# EAGLE schematic Hive_Max_Masse_neu4a (EAGLE 6.3)
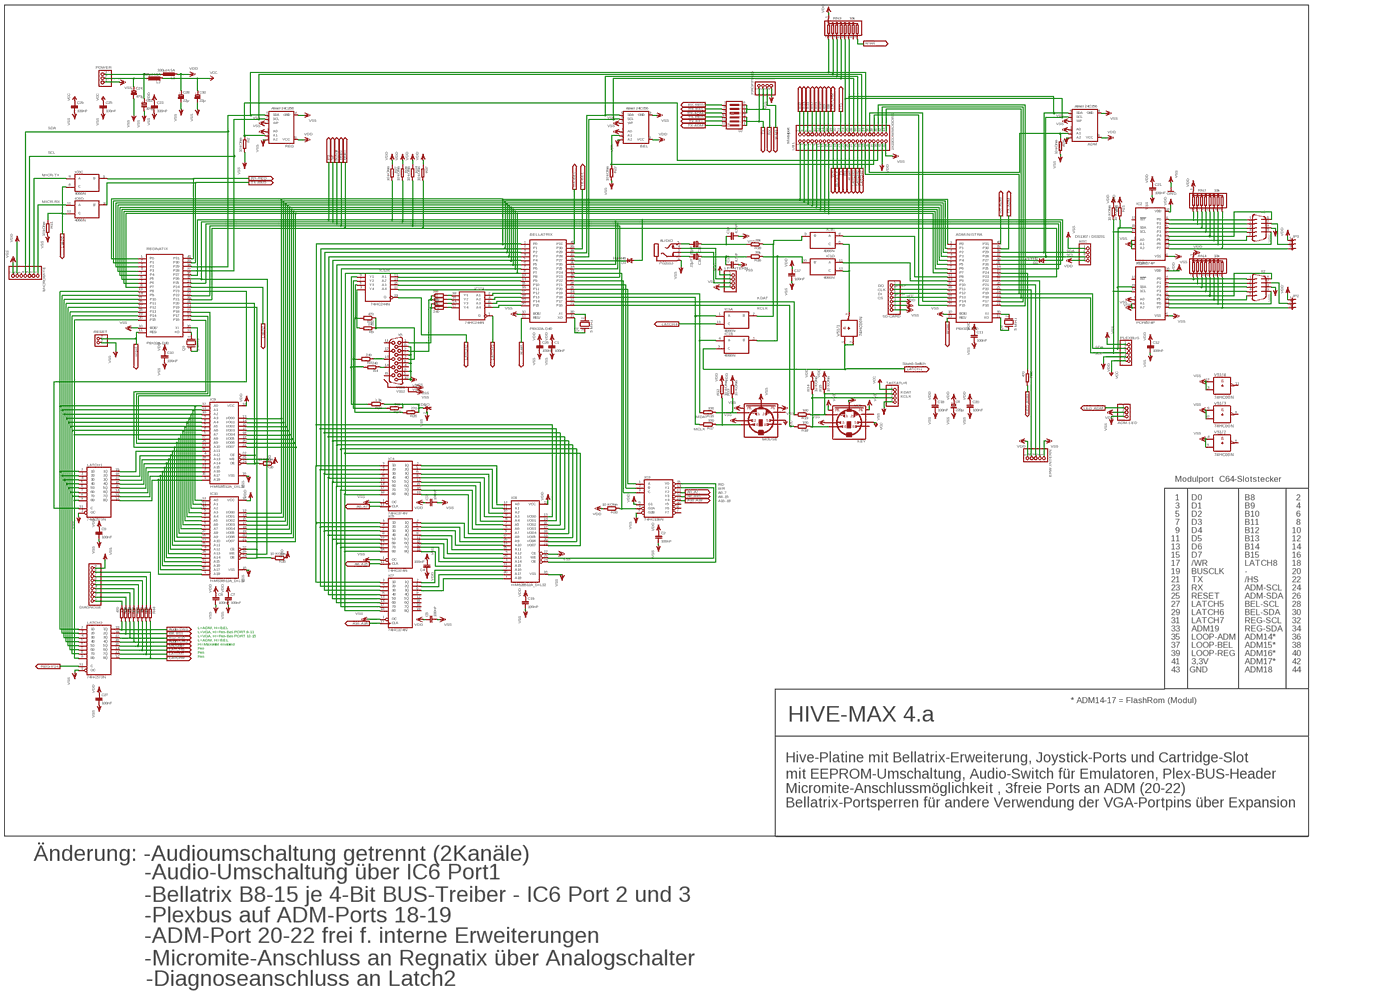
[diagram p0: schematic, sheet 1, overview]
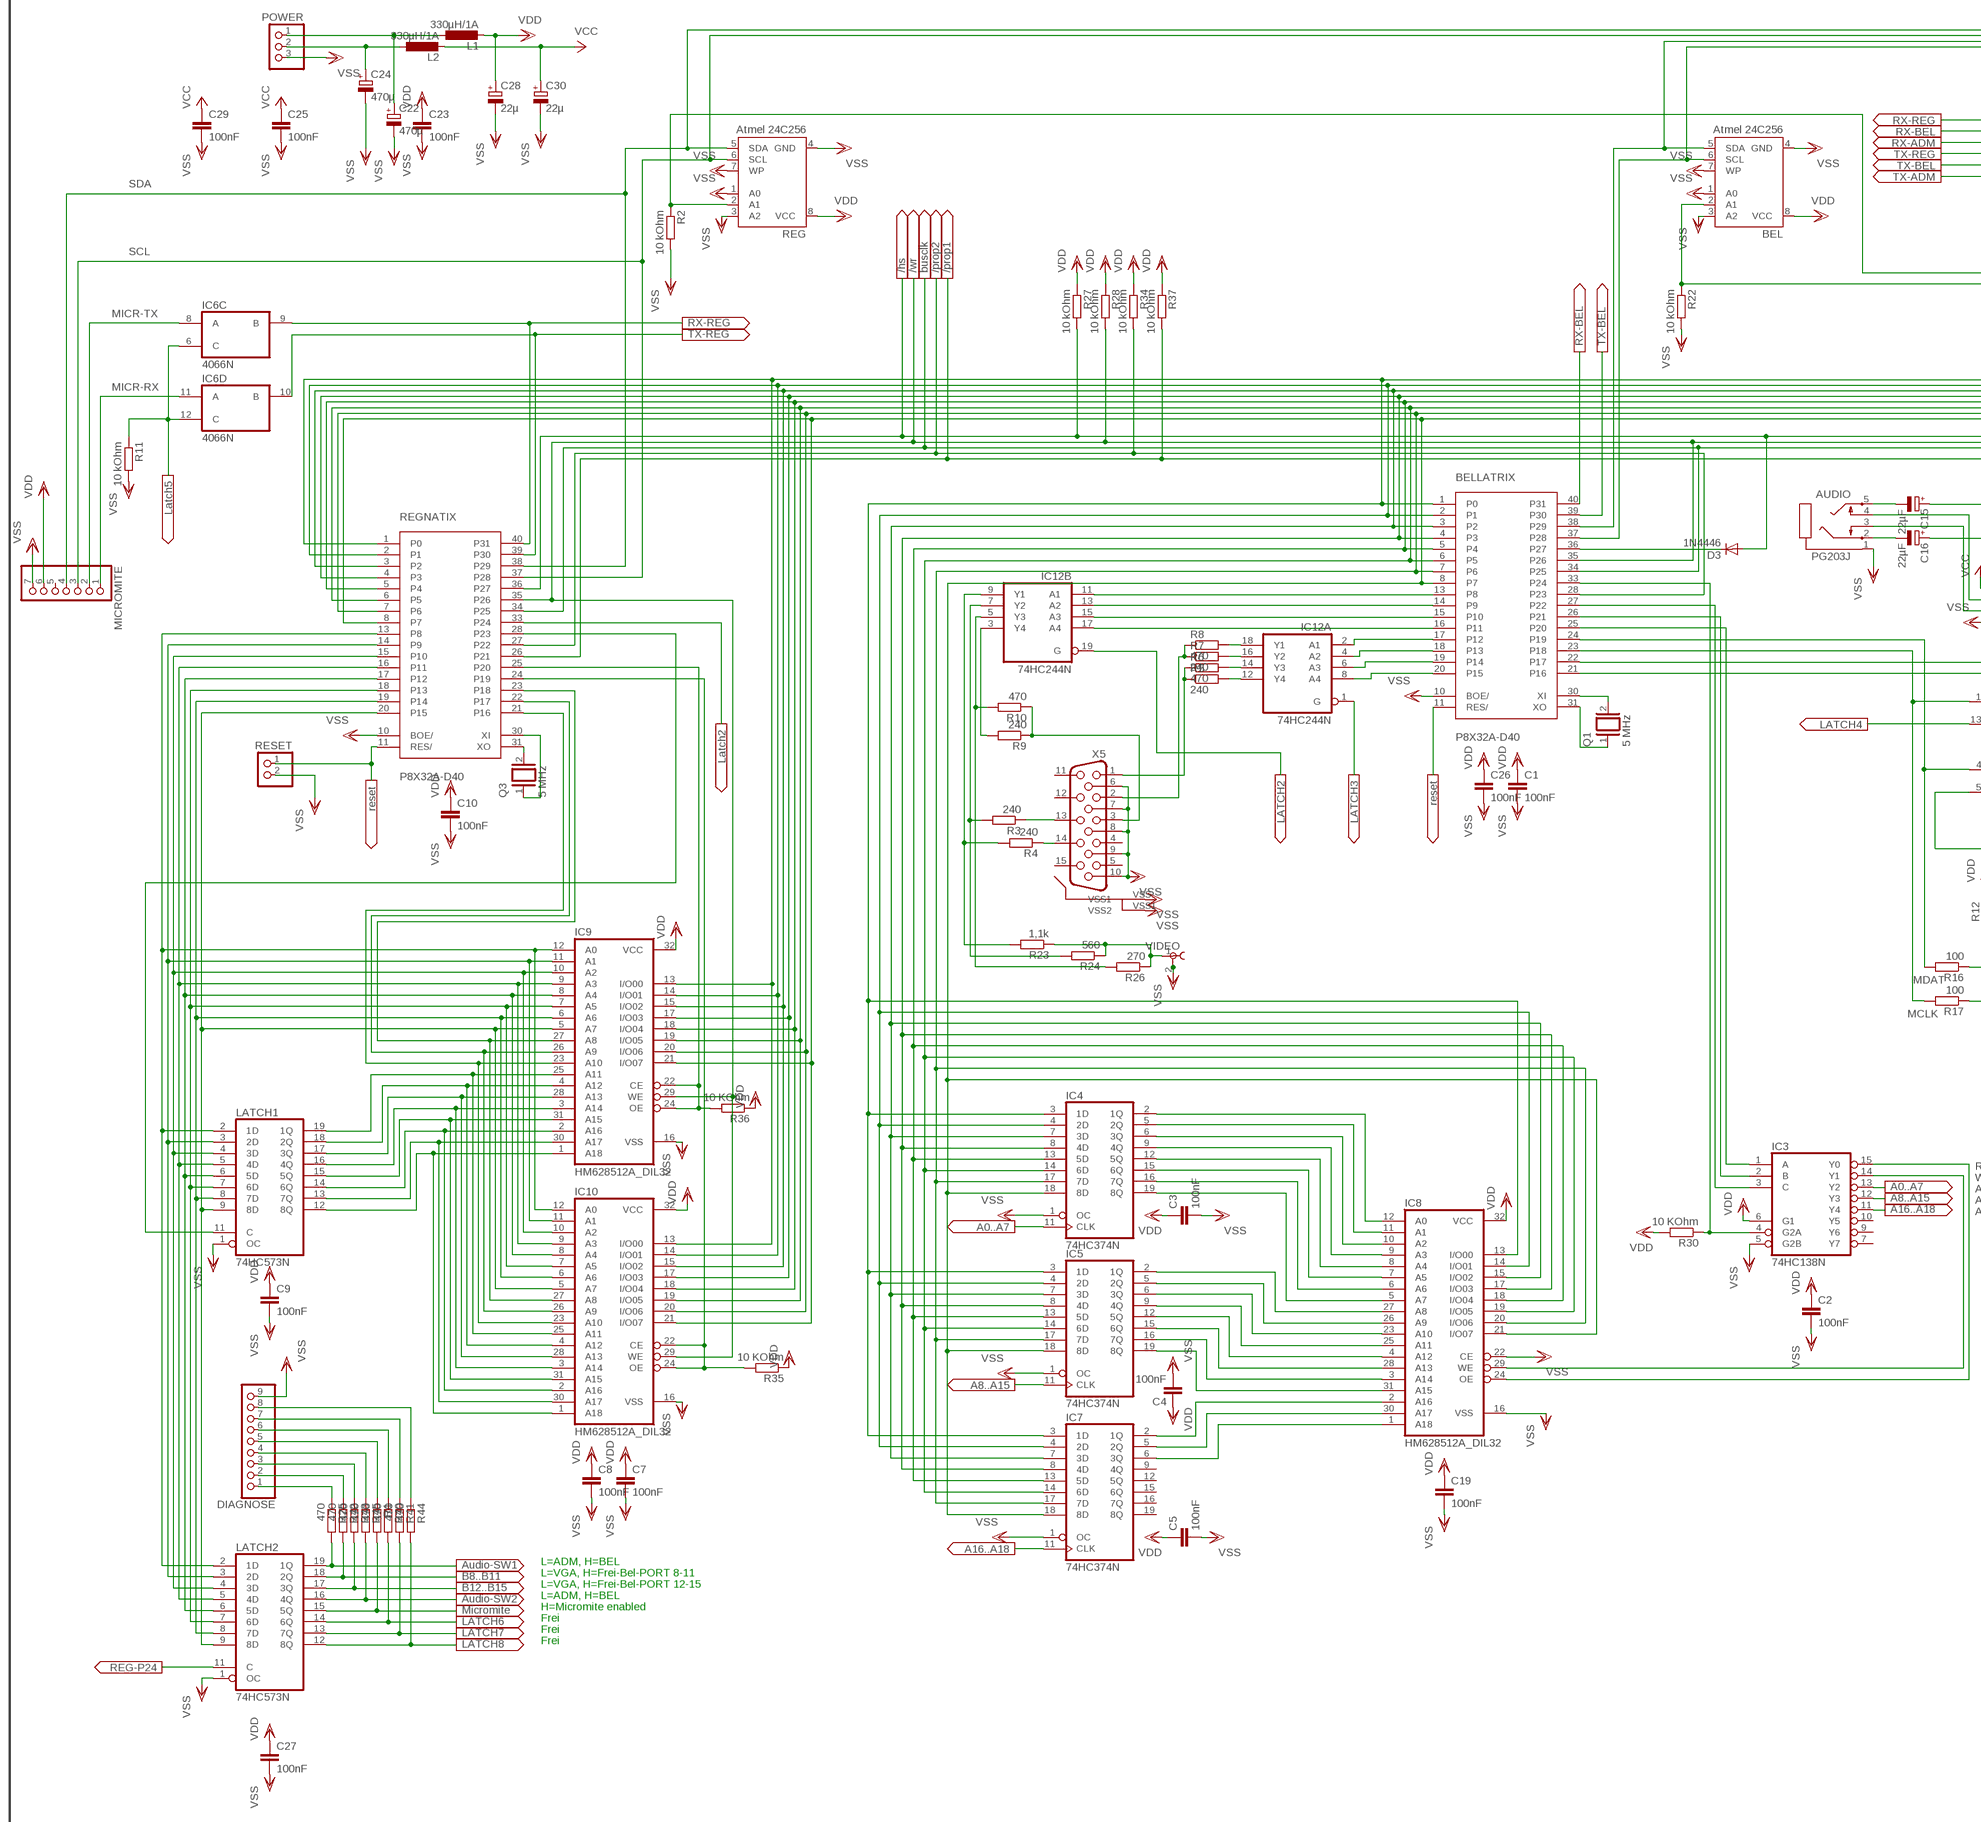
[diagram p1: schematic, sheet 1, part 1 of 4]
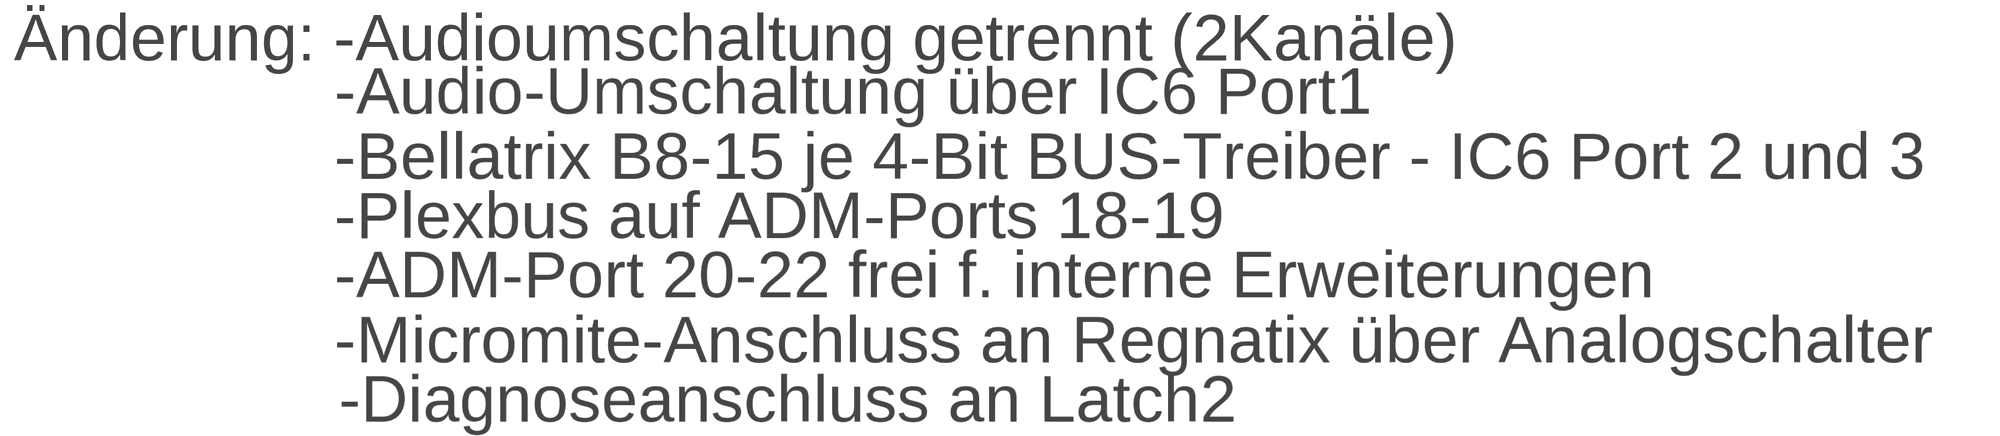
[diagram p2: schematic, sheet 1, part 2 of 4]
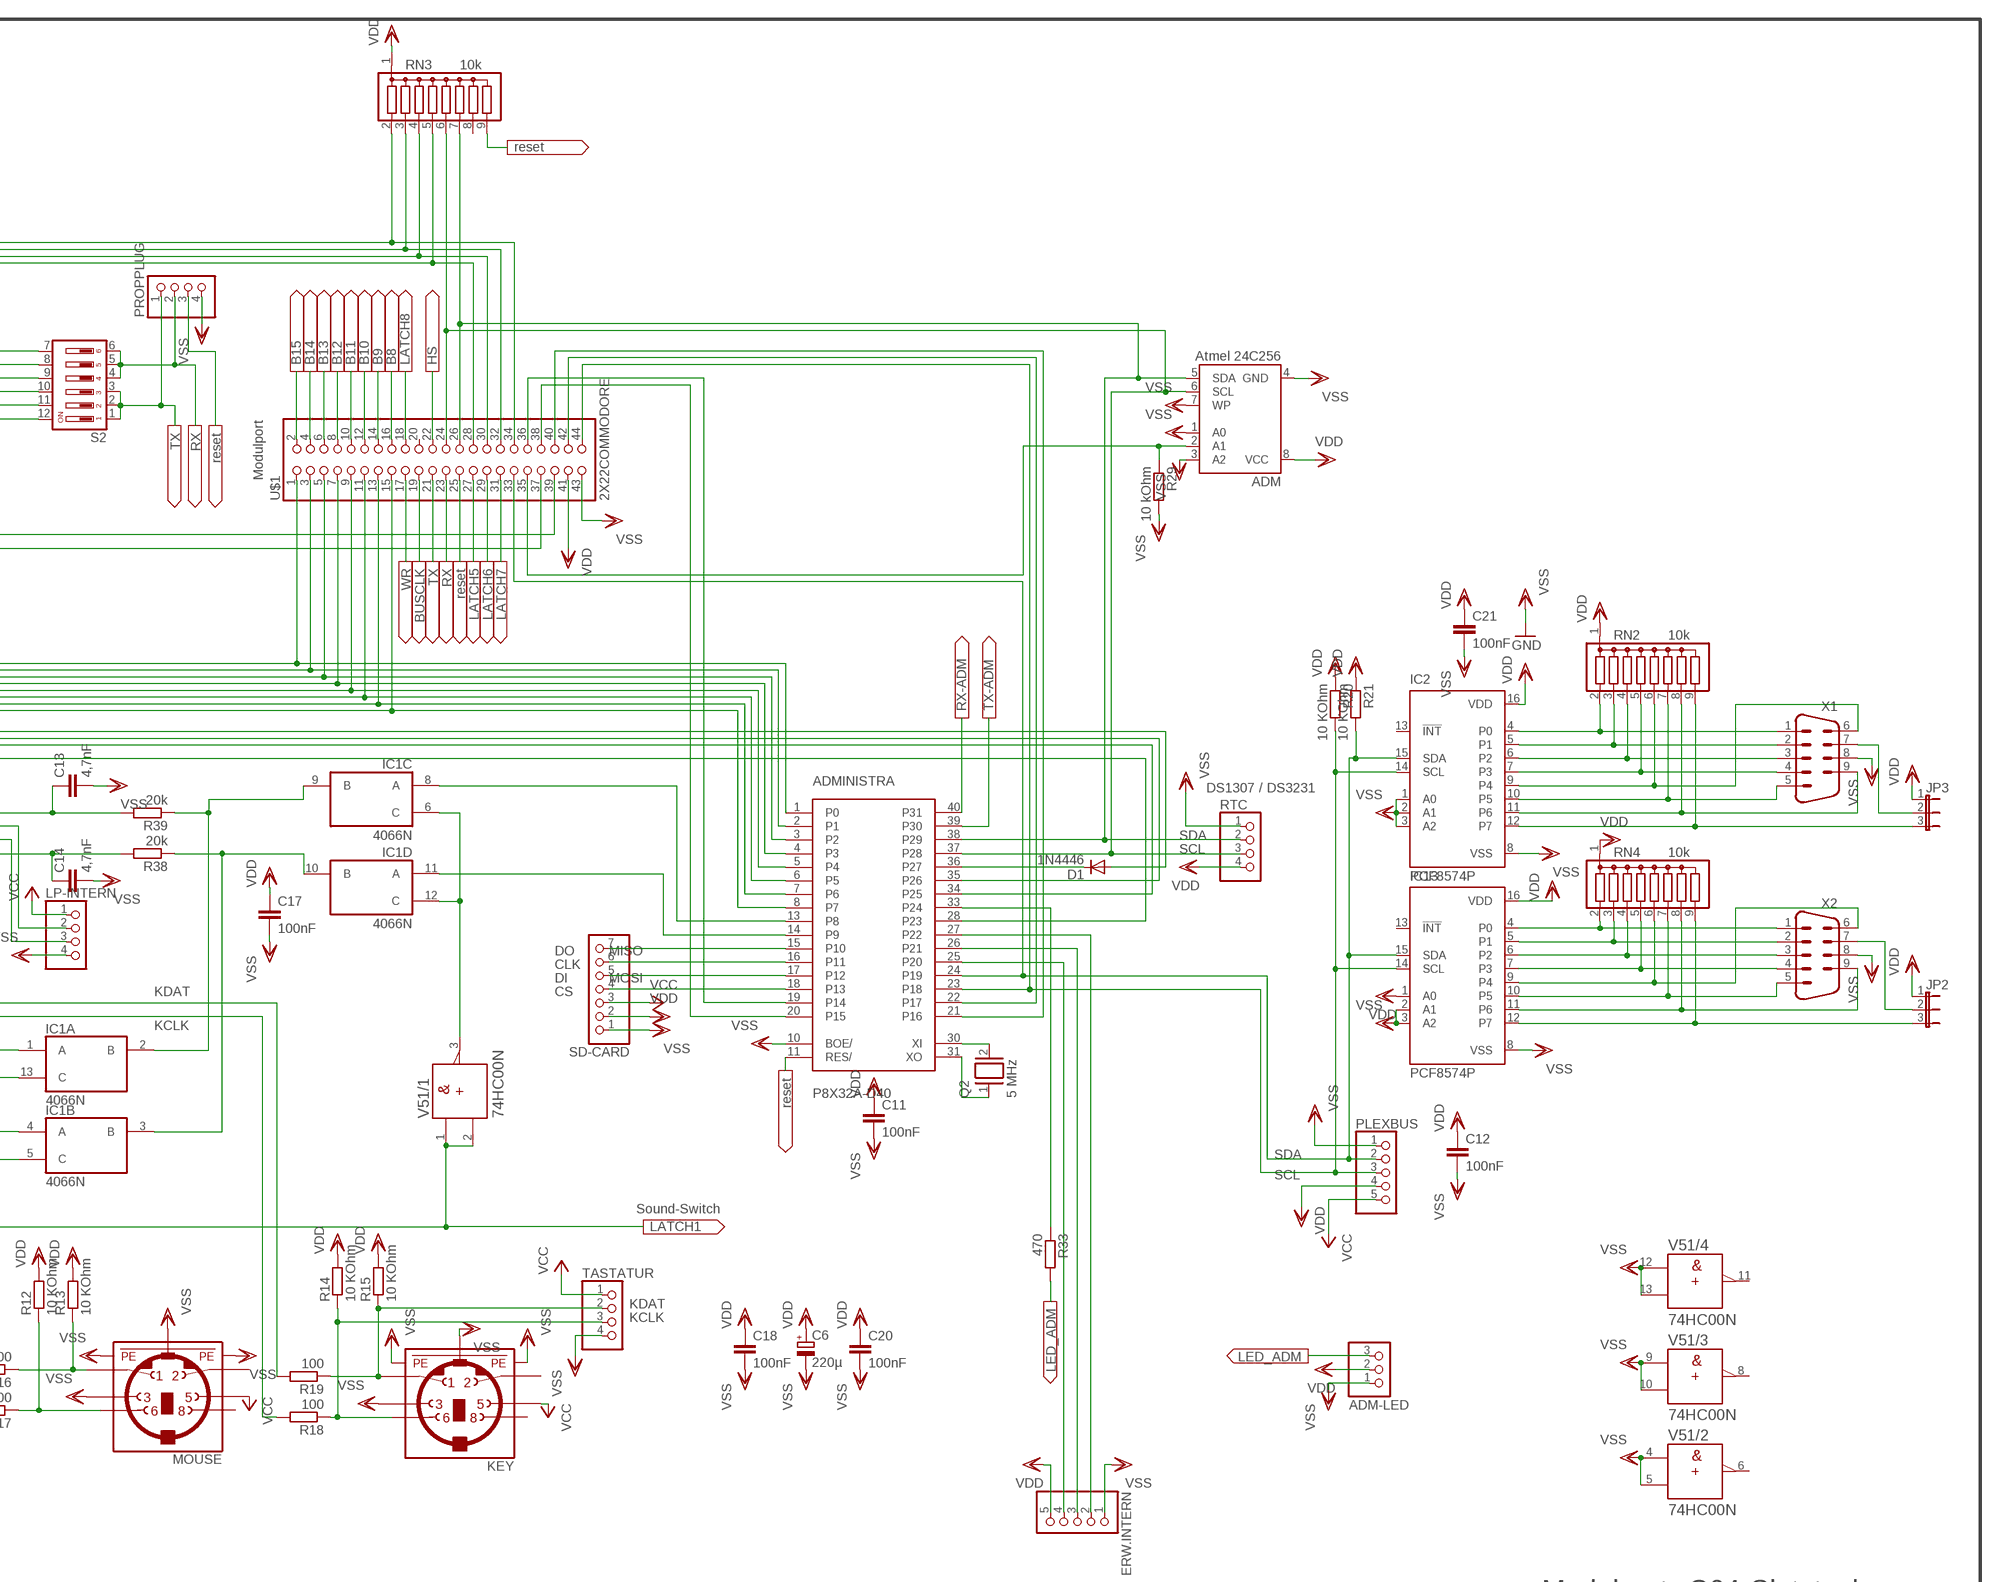
[diagram p3: schematic, sheet 1, part 3 of 4]
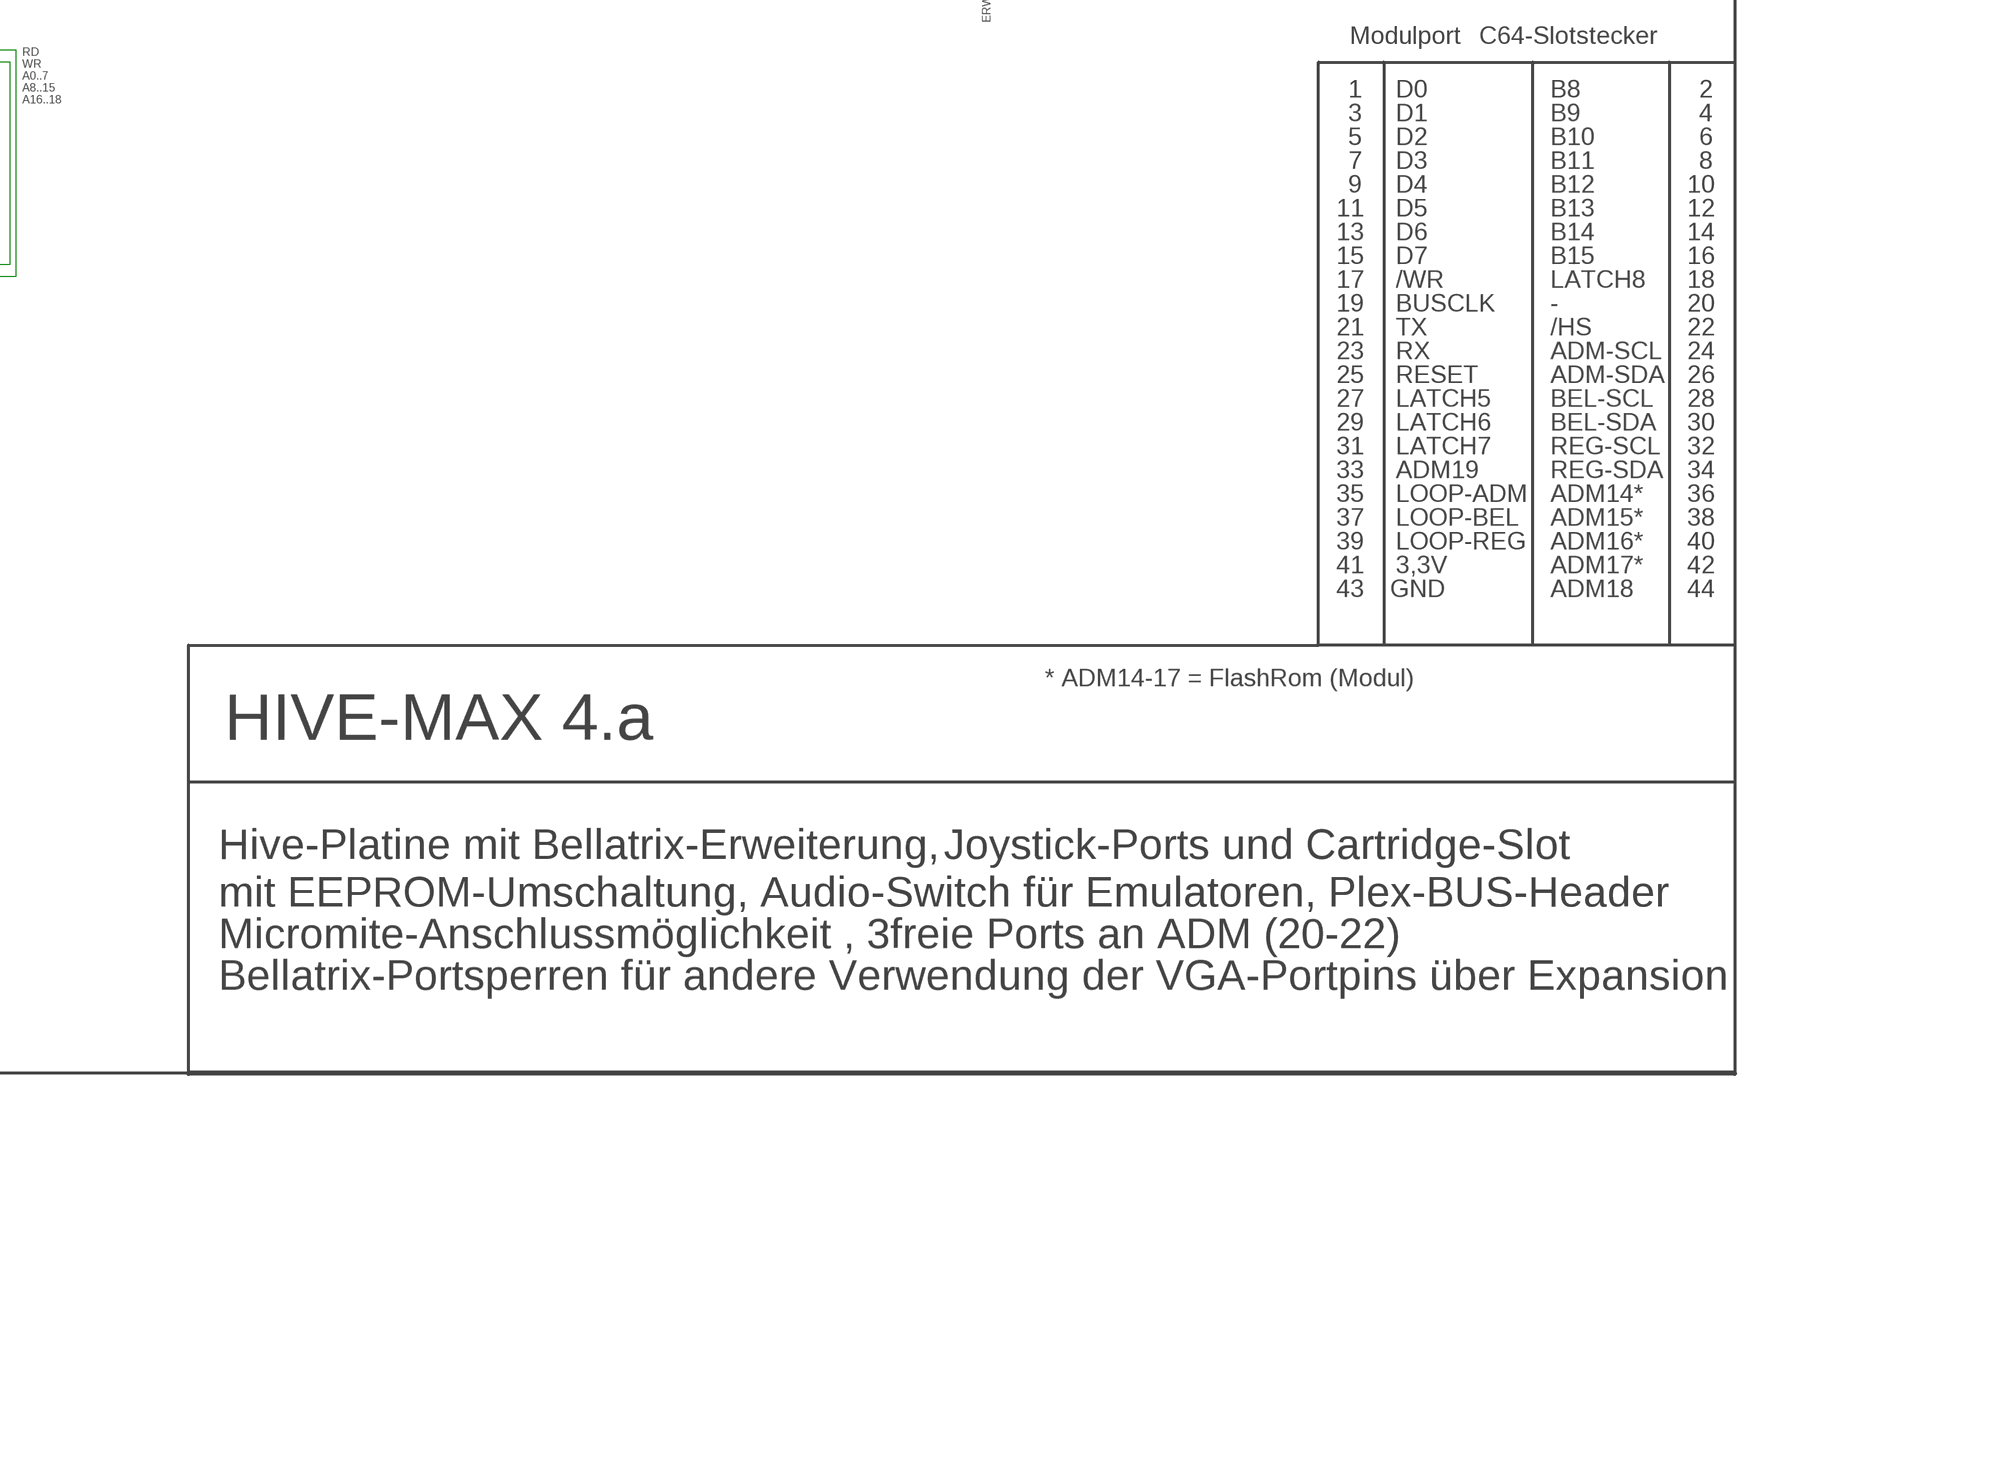
[diagram p4: schematic, sheet 1, part 4 of 4]

## Parts
ADM  Atmel 24C256  AT24CP  [DIL08]
ADM-LED  PINHD-1X3  [1X03]
ADMINISTRA  P8X32A-D40  [P8X32A-D40]
AUDIO  PG203J  [PG203J]
BEL  Atmel 24C256  AT24CP  [DIL08]
BELLATRIX  P8X32A-D40  [P8X32A-D40]
C1  100nF  C-EU025-030X050  [C025-030X050]
C2  100nF  C-EU025-030X050  [C025-030X050]
C3  100nF  C-EU025-030X050  [C025-030X050]
C4  100nF  C-EU025-030X050  [C025-030X050]
C5  100nF  C-EU025-030X050  [C025-030X050]
C6  220µ  CPOL-EUE5-8.5  [E5-8,5]
C7  100nF  C-EU025-030X050  [C025-030X050]
C8  100nF  C-EU025-030X050  [C025-030X050]
C9  100nF  C-EU025-030X050  [C025-030X050]
C10  100nF  C-EU025-030X050  [C025-030X050]
C11  100nF  C-EU025-030X050  [C025-030X050]
C12  100nF  C-EU025-030X050  [C025-030X050]
C13  4,7nF  C-EU025-030X050  [C025-030X050]
C14  4,7nF  C-EU025-030X050  [C025-030X050]
C15  22µF  CPOL-EUE2-5  [E2-5]
C16  22µF  CPOL-EUE2-5  [E2-5]
C17  100nF  C-EU025-030X050  [C025-030X050]
C18  100nF  C-EU025-030X050  [C025-030X050]
C19  100nF  C-EU025-030X050  [C025-030X050]
C20  100nF  C-EU025-030X050  [C025-030X050]
C21  100nF  C-EU025-030X050  [C025-030X050]
C22  470µ  CPOL-EUE5-8.5  [E5-8,5]
C23  100nF  C-EU025-030X050  [C025-030X050]
C24  470µ  CPOL-EUE5-8.5  [E5-8,5]
C25  100nF  C-EU025-030X050  [C025-030X050]
C26  100nF  C-EU025-030X050  [C025-030X050]
C27  100nF  C-EU025-030X050  [C025-030X050]
C28  22µ  CPOL-EUE2-5  [E2-5]
C29  100nF  C-EU025-030X050  [C025-030X050]
C30  22µ  CPOL-EUE2-5  [E2-5]
D1  1N4446  [DO35-10]
D3  1N4446  [DO35-10]
DIAGNOSE  PINHD-1X9  [1X09]
ERW.INTERN  PINHD-1X5  [1X05]
IC1  4066N  [DIL14]
IC2  PCF8574P  [DIL16]
IC3  74HC138N  [DIL16]
IC4  74HC374N  [DIL20]
IC5  74HC374N  [DIL20]
IC6  4066N  [DIL14]
IC7  74HC374N  [DIL20]
IC8  HM628512A_DIL32  [DIL32]
IC9  HM628512A_DIL32  [DIL32]
IC10  HM628512A_DIL32  [DIL32]
IC12  74HC244N  [DIL20]
IC13  PCF8574P  [DIL16]
JP2  JP2E  [JP2]
JP3  JP2E  [JP2]
KEY  MINI_DIN_6  [M_DIN6]
L1  330µH/1A  L-EU6000-XXX-RC  [6000-XXXX-RC]
L2  330µH/1A  L-EU6000-XXX-RC  [6000-XXXX-RC]
LATCH1  74HC573N  [DIL20]
LATCH2  74HC573N  [DIL20]
LP-INTERN  PINHD-1X4  [1X04]
MICROMITE  PINHD-1X7  [1X07]
MOUSE  MINI_DIN_6  [M_DIN6]
PLEXBUS  PINHD-1X5  [1X05]
POWER  PINHD-1X3  [1X03]
PROPPLUG  PINHD-1X4/90  [1X04/90]
Q1  5 MHz  XTAL/S  [QS]
Q2  5 MHz  XTAL/S  [QS]
Q3  5 MHz  XTAL/S  [QS]
R1  470  R-EU_0204/2V  [0204V]
R2  10 kOhm  R-EU_0204/2V  [0204V]
R3  240  R-EU_0204/2V  [0204V]
R4  240  R-EU_0204/2V  [0204V]
R5  240  R-EU_0204/2V  [0204V]
R6  470  R-EU_0204/2V  [0204V]
R7  240  R-EU_0204/2V  [0204V]
R8  470  R-EU_0204/2V  [0204V]
R9  240  R-EU_0204/2V  [0204V]
R10  470  R-EU_0204/2V  [0204V]
R11  10 kOhm  R-EU_0204/2V  [0204V]
R12  10 KOhm  R-EU_0204/2V  [0204V]
R13  10 KOhm  R-EU_0204/2V  [0204V]
R14  10 KOhm  R-EU_0204/2V  [0204V]
R15  10 KOhm  R-EU_0204/2V  [0204V]
R16  100  R-EU_0204/2V  [0204V]
R17  100  R-EU_0204/2V  [0204V]
R18  100  R-EU_0204/2V  [0204V]
R19  100  R-EU_0204/2V  [0204V]
R20  10 KOhm  R-EU_0204/2V  [0204V]
R21  10 KOhm  R-EU_0204/2V  [0204V]
R22  10 kOhm  R-EU_0204/2V  [0204V]
R23  1,1k  R-EU_0204/2V  [0204V]
R24  560  R-EU_0204/2V  [0204V]
R25  470  R-EU_0204/2V  [0204V]
R26  270  R-EU_0204/2V  [0204V]
R27  10 kOhm  R-EU_0204/2V  [0204V]
R28  10 kOhm  R-EU_0204/2V  [0204V]
R29  10 kOhm  R-EU_0204/2V  [0204V]
R30  10 KOhm  R-EU_0204/2V  [0204V]
R33  470  R-EU_0204/2V  [0204V]
R34  10 kOhm  R-EU_0204/2V  [0204V]
R35  10 KOhm  R-EU_0204/2V  [0204V]
R36  10 KOhm  R-EU_0204/2V  [0204V]
R37  10 kOhm  R-EU_0204/2V  [0204V]
R38  20k  R-EU_0204/2V  [0204V]
R39  20k  R-EU_0204/2V  [0204V]
R40  470  R-EU_0204/2V  [0204V]
R41  470  R-EU_0204/2V  [0204V]
R42  470  R-EU_0204/2V  [0204V]
R43  470  R-EU_0204/2V  [0204V]
R44  470  R-EU_0204/2V  [0204V]
R45  470  R-EU_0204/2V  [0204V]
REG  Atmel 24C256  AT24CP  [DIL08]
REGNATIX  P8X32A-D40  [P8X32A-D40]
RESET  PINHD-1X2  [1X02]
RN2  10k  G08R  [SIL9]
RN3  10k  G08R  [SIL9]
RN4  10k  G08R  [SIL9]
RTC  PINHD-1X4  [1X04]
S2  DA06  [DA-06]
SD-CARD  PINHD-1X7  [1X07]
TASTATUR  PINHD-1X4  [1X04]
U$1  2X22COMMODORE  [2X22-COMMODORE]
V51  74HC00N  [DIL14]
VIDEO  CINCHFEM  [TOBU3]
X1  M09HP  [M09HP]
X2  M09HP  [M09HP]
X5  HF15H  [HDF15H]

## Nets
/HS: D1.A D3.A R27.2 REGNATIX.36(P27) U$1.22
A0: IC9.12(A0) IC10.12(A0) LATCH1.2(1D) LATCH2.2(1D) REGNATIX.13(P8)
A0..A7: IC3.13(Y2) IC4.11(CLK)
A1: IC9.11(A1) IC10.11(A1) LATCH1.3(2D) LATCH2.3(2D) REGNATIX.14(P9)
A2: IC9.10(A2) IC10.10(A2) LATCH1.4(3D) LATCH2.4(3D) REGNATIX.15(P10)
A3: IC9.9(A3) IC10.9(A3) LATCH1.5(4D) LATCH2.5(4D) REGNATIX.16(P11)
A4: IC9.8(A4) IC10.8(A4) LATCH1.6(5D) LATCH2.6(5D) REGNATIX.17(P12)
A5: IC9.7(A5) IC10.7(A5) LATCH1.7(6D) LATCH2.7(6D) REGNATIX.18(P13)
A6: IC9.6(A6) IC10.6(A6) LATCH1.8(7D) LATCH2.8(7D) REGNATIX.19(P14)
A7: IC9.5(A7) IC10.5(A7) LATCH1.9(8D) LATCH2.9(8D) REGNATIX.20(P15)
A8: IC9.23(A10) IC10.23(A10) REGNATIX.21(P16)
A8..A15: IC3.12(Y3) IC5.11(CLK)
A9: IC9.26(A9) IC10.26(A9) REGNATIX.22(P17)
A10: IC9.27(A8) IC10.27(A8) REGNATIX.23(P18)
A16..A18: IC3.11(Y4) IC7.11(CLK)
ADM14: ADMINISTRA.19(P14) U$1.36
ADM15: ADMINISTRA.20(P15) U$1.38
ADM16: ADMINISTRA.21(P16) U$1.40
ADM17: ADMINISTRA.22(P17) U$1.42
ADM18: ADMINISTRA.23(P18) IC2.14(SCL) IC13.14(SCL) PLEXBUS.3 R20.2 U$1.44
ADM19: ADMINISTRA.24(P19) IC2.15(SDA) IC13.15(SDA) PLEXBUS.2 R21.2 U$1.33
ADM20: ADMINISTRA.25(P20) ERW.INTERN.4
ADM21: ADMINISTRA.26(P21) ERW.INTERN.3
ADM22: ADMINISTRA.27(P22) ERW.INTERN.2
ADM-SCL: ADM.6(SCL) ADMINISTRA.37(P28) RN3.6 RTC.3 U$1.24
ADM-SDA: ADM.5(SDA) ADMINISTRA.38(P29) RN3.7 RTC.2 U$1.26
B8: BELLATRIX.13(P8) IC12.11(B:A1) U$1.16
B9: BELLATRIX.14(P9) IC12.13(B:A2) U$1.14
B10: BELLATRIX.15(P10) IC12.15(B:A3) U$1.12
B11: BELLATRIX.16(P11) IC12.17(B:A4) U$1.10
B12: BELLATRIX.17(P12) IC12.2(A:A1) U$1.8
B13: BELLATRIX.18(P13) IC12.4(A:A2) U$1.6
B14: BELLATRIX.19(P14) IC12.6(A:A3) U$1.4
B15: BELLATRIX.20(P15) IC12.8(A:A4) U$1.2
BEL-SCL: BEL.6(SCL) BELLATRIX.37(P28) RN3.5 U$1.28
BEL-SDA: BEL.5(SDA) BELLATRIX.38(P29) RN3.4 U$1.30
BLAU: R9.1 R10.1 X5.3
BUSCLK: ADMINISTRA.34(P25) BELLATRIX.34(P25) REGNATIX.34(P25) U$1.19
CLK: KEY.6 R14.1 R18.1 TASTATUR.3
D0: ADMINISTRA.1(P0) BELLATRIX.1(P0) IC4.3(1D) IC5.3(1D) IC7.3(1D) IC8.13(I/O00) IC9.13(I/O00) IC10.13(I/O00) REGNATIX.1(P0) U$1.1
D1: ADMINISTRA.2(P1) BELLATRIX.2(P1) IC4.4(2D) IC5.4(2D) IC7.4(2D) IC8.14(I/O01) IC9.14(I/O01) IC10.14(I/O01) REGNATIX.2(P1) U$1.3
D2: ADMINISTRA.3(P2) BELLATRIX.3(P2) IC4.7(3D) IC5.7(3D) IC7.7(3D) IC8.15(I/O02) IC9.15(I/O02) IC10.15(I/O02) REGNATIX.3(P2) U$1.5
D3: ADMINISTRA.4(P3) BELLATRIX.4(P3) IC4.8(4D) IC5.8(4D) IC7.8(4D) IC8.17(I/O03) IC9.17(I/O03) IC10.17(I/O03) REGNATIX.4(P3) U$1.7
D4: ADMINISTRA.5(P4) BELLATRIX.5(P4) IC4.13(5D) IC5.13(5D) IC7.13(5D) IC8.18(I/O04) IC9.18(I/O04) IC10.18(I/O04) REGNATIX.5(P4) U$1.9
D5: ADMINISTRA.6(P5) BELLATRIX.6(P5) IC4.14(6D) IC5.14(6D) IC7.14(6D) IC8.19(I/O05) IC9.19(I/O05) IC10.19(I/O05) REGNATIX.6(P5) U$1.11
D6: ADMINISTRA.7(P6) BELLATRIX.7(P6) IC4.17(7D) IC5.17(7D) IC7.17(7D) IC8.20(I/O06) IC9.20(I/O06) IC10.20(I/O06) REGNATIX.7(P6) U$1.13
D7: ADMINISTRA.8(P7) BELLATRIX.8(P7) IC4.18(8D) IC5.18(8D) IC7.18(8D) IC8.21(I/O07) IC9.21(I/O07) IC10.21(I/O07) REGNATIX.8(P7) U$1.15
DAT: KEY.1 R15.1 R19.1 TASTATUR.2
GLOB_RESET: ADMINISTRA.11(RES/) BELLATRIX.11(RES/) PROPPLUG.3 REGNATIX.11(RES/) RESET.1 RN3.9 U$1.25
GRUEN: R7.1 R8.1 X5.2
HSYNC: R3.1 X5.13
KCLK: BELLATRIX.21(P16) R18.2
KDAT: BELLATRIX.22(P17) R19.2
LATCH1: IC1.5(B:C) LATCH2.19(1Q) R25.2 V51.1(/1:A) V51.2(/1:B)
LATCH2: IC12.19(B:G) LATCH2.18(2Q) R42.2
LATCH3: IC12.1(A:G) LATCH2.17(3Q) R43.2
LATCH4: IC1.13(A:C) LATCH2.16(4Q) R45.2
LATCH5: IC6.6(C:C) IC6.12(D:C) LATCH2.15(5Q) R1.2 R11.1 U$1.27
LATCH6: LATCH2.14(6Q) R40.2 U$1.29
LATCH7: LATCH2.13(7Q) R41.2 U$1.31
LATCH8: LATCH2.12(8Q) R44.2 U$1.18
LED_ADM: ADM-LED.3 R33.2
LOOP-ADM: ADM.2(A1) R29.1 U$1.35
LOOP-BEL: BEL.2(A1) R22.1 U$1.37
LOOP-REG: R2.1 REG.2(A1) U$1.39
MCLK: BELLATRIX.23(P18) IC1.1(A:A) R17.2
MDAT: BELLATRIX.24(P19) IC1.4(B:A) R16.2
N$1: AUDIO.4 LP-INTERN.2
N$2: AUDIO.3 LP-INTERN.3
N$4: ADMINISTRA.14(P9) IC1.11(D:A)
N$5: DIAGNOSE.1 R25.1
N$6: IC12.18(A:Y1) R8.2
N$7: IC6.11(D:A) MICROMITE.1
N$8: DIAGNOSE.2 R42.1
N$9: IC12.16(A:Y2) R7.2
N$10: IC12.14(A:Y3) R6.2
N$11 [Power]: C22.+ L1.1 POWER.1
N$12 [Power]: C24.+ L2.1 POWER.2
N$13: IC12.12(A:Y4) R5.2
N$14: IC6.8(C:A) MICROMITE.2
N$16: IC12.9(B:Y1) R4.2 R23.2
N$17: IC12.7(B:Y2) R3.2 R24.2
N$19: ADMINISTRA.30(XI) Q2.2
N$20: IC4.2(1Q) IC8.12(A0)
N$21: IC4.5(2Q) IC8.11(A1)
N$22: IC4.6(3Q) IC8.10(A2)
N$23: IC4.9(4Q) IC8.9(A3)
N$24: IC4.12(5Q) IC8.8(A4)
N$25: IC12.5(B:Y3) R10.2 R26.2
N$27: DIAGNOSE.3 R43.1
N$28: DIAGNOSE.4 R45.1
N$29: DIAGNOSE.5 R1.1
N$31: IC1.3(B:B) IC1.10(D:B) R38.1
N$32: IC1.6(C:C) IC1.12(D:C) V51.3(/1:Y)
N$33: IC12.3(B:Y4) R9.2
N$35: DIAGNOSE.6 R40.1
N$36: DIAGNOSE.7 R41.1
N$37: DIAGNOSE.8 R44.1
N$39: BELLATRIX.30(XI) Q1.2
N$40: BELLATRIX.31(XO) Q1.1
N$42: BELLATRIX.36(P27) D3.C
N$43: IC1.2(A:B) IC1.9(C:B) R39.1
N$44: MOUSE.1 R13.1 R16.1
N$45: MOUSE.6 R12.1 R17.1
N$46: ADMINISTRA.33(P24) R33.1
N$52: IC4.15(6Q) IC8.7(A5)
N$53: IC4.16(7Q) IC8.6(A6)
N$54: IC4.19(8Q) IC8.5(A7)
N$55: R23.1 R24.1 R26.1 VIDEO.1
N$58: ADMINISTRA.31(XO) Q2.1
N$59: IC5.2(1Q) IC8.27(A8)
N$60: ADMINISTRA.15(P10) SD-CARD.7
N$61: ADMINISTRA.16(P11) SD-CARD.6
N$62: ADMINISTRA.17(P12) SD-CARD.5
N$63: ADMINISTRA.36(P27) D1.C
N$64: ADMINISTRA.18(P13) SD-CARD.4
N$65: Q3.2 REGNATIX.31(XO)
N$66: Q3.1 REGNATIX.30(XI)
N$70: IC2.7(P3) RN2.5 X1.4
N$71: IC2.4(P0) RN2.2 X1.1
N$72: IC5.5(2Q) IC8.26(A9)
N$73: IC5.6(3Q) IC8.23(A10)
N$74: IC5.9(4Q) IC8.25(A11)
N$76: IC5.12(5Q) IC8.4(A12)
N$77: IC5.15(6Q) IC8.28(A13)
N$78: IC5.16(7Q) IC8.3(A14)
N$79: IC5.19(8Q) IC8.31(A15)
N$80: IC7.2(1Q) IC8.2(A16)
N$81: IC7.5(2Q) IC8.30(A17)
N$82: IC7.6(3Q) IC8.1(A18)
N$83: IC9.25(A11) IC10.25(A11) LATCH1.19(1Q)
N$84: IC9.4(A12) IC10.4(A12) LATCH1.18(2Q)
N$85: IC9.28(A13) IC10.28(A13) LATCH1.17(3Q)
N$86: IC9.3(A14) IC10.3(A14) LATCH1.16(4Q)
N$87: IC9.31(A15) IC10.31(A15) LATCH1.15(5Q)
N$88: IC9.2(A16) IC10.2(A16) LATCH1.14(6Q)
N$91: IC9.30(A17) IC10.30(A17) LATCH1.13(7Q)
N$92: IC9.1(A18) IC10.1(A18) LATCH1.12(8Q)
N$93: LATCH1.11(C) REGNATIX.28(P23)
N$96: IC2.5(P1) RN2.3 X1.2
N$97: IC2.6(P2) RN2.4 X1.3
N$98: IC13.7(P3) RN4.5 X2.4
N$99: IC13.9(P4) RN4.6 X2.6
N$100: IC2.10(P5) RN2.7 X1.5
N$101: IC2.9(P4) RN2.6 X1.6
N$102: IC2.12(P7) JP3.3 RN2.9
N$103: IC13.4(P0) RN4.2 X2.1
N$104: IC13.5(P1) RN4.3 X2.2
N$105: IC13.6(P2) RN4.4 X2.3
N$106: IC13.11(P6) RN4.8 X2.9
N$107: IC2.11(P6) RN2.8 X1.9
N$108: IC13.10(P5) RN4.7 X2.5
N$109: JP2.2 X2.7
N$110: IC13.12(P7) JP2.3 RN4.9
N$111: JP3.2 X1.7
N$113: ADMINISTRA.13(P8) IC1.8(C:A)
N$114: AUDIO.2 C16.-
N$115: AUDIO.5 C15.-
N$116: C13.1 C15.+ R39.2
N$117: C14.1 C16.+ R38.2
PROP1: ADMINISTRA.28(P23) R37.2 REGNATIX.26(P21)
PROP2: BELLATRIX.28(P23) R34.2 REGNATIX.27(P22)
RAM1: IC10.22(CE) IC10.24(OE) R35.2 REGNATIX.24(P19)
RAM2: IC9.22(CE) IC9.24(OE) R36.2 REGNATIX.25(P20)
RAM-RD: IC3.15(Y0) IC8.24(OE)
RAM-WR: IC3.14(Y1) IC8.29(WE)
REG-P24: LATCH2.11(C) REGNATIX.33(P24)
REG-SCL: MICROMITE.3 REG.6(SCL) REGNATIX.37(P28) RN3.3 U$1.32
REG-SDA: MICROMITE.4 REG.5(SDA) REGNATIX.38(P29) RN3.2 U$1.34
ROT: R5.1 R6.1 X5.1
RX: PROPPLUG.2 S2.4 S2.5 S2.6 U$1.23
RX-ADM: ADMINISTRA.40(P31) S2.9
RX-BEL: BELLATRIX.40(P31) S2.8
RX-REG: IC6.9(C:B) REGNATIX.40(P31) S2.7
TX: PROPPLUG.1 S2.1 S2.2 S2.3 U$1.21
TX-ADM: ADMINISTRA.39(P30) S2.12
TX-BEL: BELLATRIX.39(P30) S2.11
TX-REG: IC6.10(D:B) REGNATIX.39(P30) S2.10
VCC [Power]: C25.1 C29.1 C30.+ KEY.5 L2.2 LP-INTERN.1 MOUSE.5 PLEXBUS.5 SD-CARD.3 TASTATUR.1
VDD [Power]: ADM-LED.2 ADM.8(VCC) BEL.8(VCC) C1.1 C2.1 C3.1 C4.1 C5.1 C6.+ C7.1 C8.1 C9.1 C10.1 C11.1 C12.1 C17.1 C18.1 C19.1 C20.1 C21.1 C23.1 C26.1 C27.1 C28.+ ERW.INTERN.5 IC2.16(VDD) IC3.6(G1) IC8.32(VCC) IC9.32(VCC) IC10.32(VCC) IC13.1(A0) IC13.16(VDD) JP2.1 JP3.1 L1.2 MICROMITE.6 PLEXBUS.4 R12.2 R13.2 R14.2 R15.2 R20.1 R21.1 R27.1 R28.1 R30.2 R34.1 R35.1 R36.1 R37.1 REG.8(VCC) RN2.1 RN3.1 RN4.1 RTC.4 SD-CARD.2 U$1.41
VSS [Power]: ADM-LED.1 ADM.1(A0) ADM.3(A2) ADM.4(GND) ADM.7(WP) ADMINISTRA.10(BOE/) AUDIO.1 BEL.1(A0) BEL.3(A2) BEL.4(GND) BEL.7(WP) BELLATRIX.10(BOE/) C1.2 C2.2 C3.2 C4.2 C5.2 C6.- C7.2 C8.2 C9.2 C10.2 C11.2 C12.2 C13.2 C14.2 C17.2 C18.2 C19.2 C20.2 C21.2 C22.- C23.2 C24.- C25.2 C26.2 C27.2 C28.- C29.2 C30.- DIAGNOSE.9 ERW.INTERN.1 IC2.1(A0) IC2.2(A1) IC2.3(A2) IC2.8(VSS) IC3.5(G2B) IC4.1(OC) IC5.1(OC) IC7.1(OC) IC8.16(VSS) IC8.22(CE) IC9.16(VSS) IC10.16(VSS) IC13.2(A1) IC13.3(A2) IC13.8(VSS) KEY.3 KEY.SH1(PE1) KEY.SH2(PE2) KEY.SH3(PE3) LATCH1.1(OC) LATCH2.1(OC) LP-INTERN.4 MICROMITE.7 MOUSE.3 MOUSE.SH1(PE1) MOUSE.SH2(PE2) MOUSE.SH3(PE3) PLEXBUS.1 POWER.3 PROPPLUG.4 R2.2 R11.2 R22.2 R29.2 REG.1(A0) REG.3(A2) REG.4(GND) REG.7(WP) REGNATIX.10(BOE/) RESET.2 RTC.1 SD-CARD.1 TASTATUR.4 U$1.43 V51.4(/2:A) V51.5(/2:B) V51.9(/3:A) V51.10(/3:B) V51.12(/4:A) V51.13(/4:B) VIDEO.2 VIDEO.2@1 VIDEO.2@2 X1.8 X2.8 X5.6 X5.7 X5.8 X5.9 X5.10 X5.VSS1(VSS2) X5.VSS(VSS1) ; supply symbol labelled GND
VSYNC: R4.1 X5.14
WR: ADMINISTRA.35(P26) BELLATRIX.35(P26) IC9.29(WE) IC10.29(WE) R28.2 REGNATIX.35(P26) U$1.17
Y1: BELLATRIX.25(P20) IC3.1(A)
Y2: BELLATRIX.26(P21) IC3.2(B)
Y3: BELLATRIX.27(P22) IC3.3(C)
Y4: BELLATRIX.33(P24) IC3.4(G2A) R30.1
Unconnected: IC2.13(!INT) IC3.7(Y7) IC3.9(Y6) IC3.10(Y5) IC6.1(A:A) IC6.2(A:B) IC6.3(B:B) IC6.4(B:A) IC6.5(B:C) IC6.13(A:C) IC7.9(4Q) IC7.12(5Q) IC7.15(6Q) IC7.16(7Q) IC7.19(8Q) IC13.13(!INT) KEY.2 KEY.8 MICROMITE.5 MOUSE.2 MOUSE.8 RN3.8 U$1.20 V51.6(/2:Y) V51.8(/3:Y) V51.11(/4:Y) X5.4 X5.5 X5.11 X5.12 X5.15

## Notes on the sheet
- SDA
- Modulport
- SCL
- MICR-TX
- MICR-RX
- DS1307 / DS3231
- SDA
- SCL
- DO | MISO
- CLK
- DI | MOSI
- KDAT | CS
- KCLK
- SDA
- SCL
- Sound-Switch
- KDAT
- KCLK
- MDAT
- MCLK
- Modulport | C64-Slotstecker
- RD
- WR
- A0..7
- A8..15
- 1 | D0 | B8 | 2
- A16..18
- 3 | D1 | B9 | 4
- 5 | D2 | B10 | 6
- 7 | D3 | B11 | 8
- 9 | D4 | B12 | 10
- 11 | D5 | B13 | 12
- 13 | D6 | B14 | 14
- 15 | D7 | B15 | 16
- 17 | /WR | LATCH8 | 18
- 19 | BUSCLK | - | 20
- 21 | TX | /HS | 22
- 23 | RX | ADM-SCL | 24
- 25 | RESET | ADM-SDA | 26
- 27 | LATCH5 | BEL-SCL | 28
- 29 | LATCH6 | BEL-SDA | 30
- 31 | LATCH7 | REG-SCL | 32
- L=ADM, H=BEL
- 33 | ADM19 | REG-SDA | 34
- L=VGA, H=Frei-Bel-PORT 8-11
- L=VGA, H=Frei-Bel-PORT 12-15
- 35 | LOOP-ADM | ADM14* | 36
- L=ADM, H=BEL
- H=Micromite enabled
- 37 | LOOP-BEL | ADM15* | 38
- Frei
- Frei
- 39 | LOOP-REG | ADM16* | 40
- Frei
- 41 | 3,3V | ADM17* | 42
- 43 | GND | ADM18 | 44
- * ADM14-17 = FlashRom (Modul)
- HIVE-MAX 4.a
- Hive-Platine mit Bellatrix-Erweiterung, | Joystick-Ports und Cartridge-Slot
- mit EEPROM-Umschaltung, Audio-Switch für Emulatoren, Plex-BUS-Header
- Micromite-Anschlussmöglichkeit , 3freie Ports an ADM (20-22)
- Bellatrix-Portsperren für andere Verwendung der VGA-Portpins über Expansion
- Änderung: -Audioumschaltung getrennt (2Kanäle)
- -Audio-Umschaltung über IC6 Port1
- -Bellatrix B8-15 je 4-Bit BUS-Treiber - IC6 Port 2 und 3
- -Plexbus auf ADM-Ports 18-19
- -ADM-Port 20-22 frei f. interne Erweiterungen
- -Micromite-Anschluss an Regnatix über Analogschalter
- -Diagnoseanschluss an Latch2

## Power pins joined to a net without a drawn wire
VDD: ADMINISTRA.12(VDD) ADMINISTRA.32(VDD) BELLATRIX.12(VDD) BELLATRIX.32(VDD) IC1.14(P:VDD) IC3.16(VDD) IC4.20(VDD) IC5.20(VDD) IC6.14(P:VDD) IC7.20(VDD) IC12.20(P:VDD) LATCH1.20(VDD) LATCH2.20(VDD) REGNATIX.12(VDD) REGNATIX.32(VDD) V51.14(/+UB:VDD)
VSS: ADMINISTRA.9(GND) ADMINISTRA.29(GND) BELLATRIX.9(GND) BELLATRIX.29(GND) IC1.7(P:VSS) IC3.8(GND) IC4.10(GND) IC5.10(GND) IC6.7(P:VSS) IC7.10(GND) IC12.10(P:GND) LATCH1.10(GND) LATCH2.10(GND) REGNATIX.9(GND) REGNATIX.29(GND) V51.7(/-UB:VSS)

## Library data of the parts
ADM BEL REG = atmel:AT24C*: 2-wire serial EEPROM
ADM-LED POWER = pinhead:PINHD-1X3: PIN HEADER
ADMINISTRA BELLATRIX REGNATIX = parallax_propeller:P8X32A-D40
AUDIO = con-hirschmann:PG203J: MIC/HEADPHONE JACK KS-S stereo microphone/headphone jack PG203JN (Schukat); OC_FARNELL: unknown; OC_NEWARK: unknown
C1-C5 C7-C14 C17-C21 C23 C25-C27 C29 = rcl:C-EU: CAPACITOR, European symbol
C6 C15 C16 C22 C24 C28 C30 = rcl:CPOL-EU: POLARIZED CAPACITOR, European symbol
D1 D3 = diode:1N4446: DIODE high speed (Philips)
DIAGNOSE = pinhead:PINHD-1X9: PIN HEADER
ERW.INTERN PLEXBUS = pinhead:PINHD-1X5: PIN HEADER
IC1 IC6 = 40xx:4066: Quad bilateral ANALOG SWITCH
IC2 IC13 = micro-philips:PCF8574: I2C-Bus Remote 8-bit I/O expander http://www.semiconductors.philips.com/acrobat_download/datasheets/PCF8574_4.pdf; MPN: PCF8574PN; OC_FARNELL: 204020; OC_NEWARK: 11N8515
IC3 = 74xx-eu:74*138: 3-line to 8-line DECODER/DEMULTIPLEXER
IC4 IC5 IC7 = 74xx-eu:74*374: Octal D type transparent LATCH, edge triggered
IC8-IC10 = hitachi_sram_hm628512a-series_rev1:HM628512A_DIL32: 4M SRAM 512kword x 8bit
IC12 = 74xx-eu:74*244: Octal BUFFER and LINE DRIVER, 3-state
JP2 JP3 = jumper:JP2E: JUMPER
KEY MOUSE = mini_din:MINI_DIN_6
L1 L2 = rcl:L-EU: INDUCTOR, European symbol
LATCH1 LATCH2 = 74xx-eu:74*573: 8-bit D latch BUS DRIVER
LP-INTERN PROPPLUG RTC TASTATUR = pinhead:PINHD-1X4: PIN HEADER
MICROMITE SD-CARD = pinhead:PINHD-1X7: PIN HEADER
Q1-Q3 = special:XTAL/S: CRYSTAL
R1-R30 R33-R45 = rcl:R-EU_: RESISTOR, European symbol
RESET = pinhead:PINHD-1X2: PIN HEADER
RN2-RN4 = resistor-sil:G08R: SIL RESISTOR; OC_FARNELL: unknown; OC_NEWARK: unknown
S2 = switch-dil:DA06: DIL/CODE SWITCH; MPN: MCDA06; OC_FARNELL: 9471553; OC_NEWARK: 26M1091
U$1 = pinhead:2X22COMMODORE
V51 = 74ttl-din:74*00: Quad 2-input NAND gate
VIDEO = 0RB_Connectors:CINCHFEM: Female Cinch CONNECTOR
X1 X2 = con-subd:M09: SUB-D; OC_FARNELL: unknown; OC_NEWARK: unknown
X5 = con-subd:HF15: SUB-D; OC_FARNELL: unknown; OC_NEWARK: unknown

## Net classes
0 default: width 0.254 mm, clearance 0.254 mm
1 Power: width 0.635 mm, drill 0.61 mm, clearance 0.381 mm
2 AudioVideo: width 0.254 mm, clearance 0.254 mm
3 Priority: width 0.279 mm, clearance 0.279 mm